# EAGLE schematic tinyio (EAGLE 7.1.0)
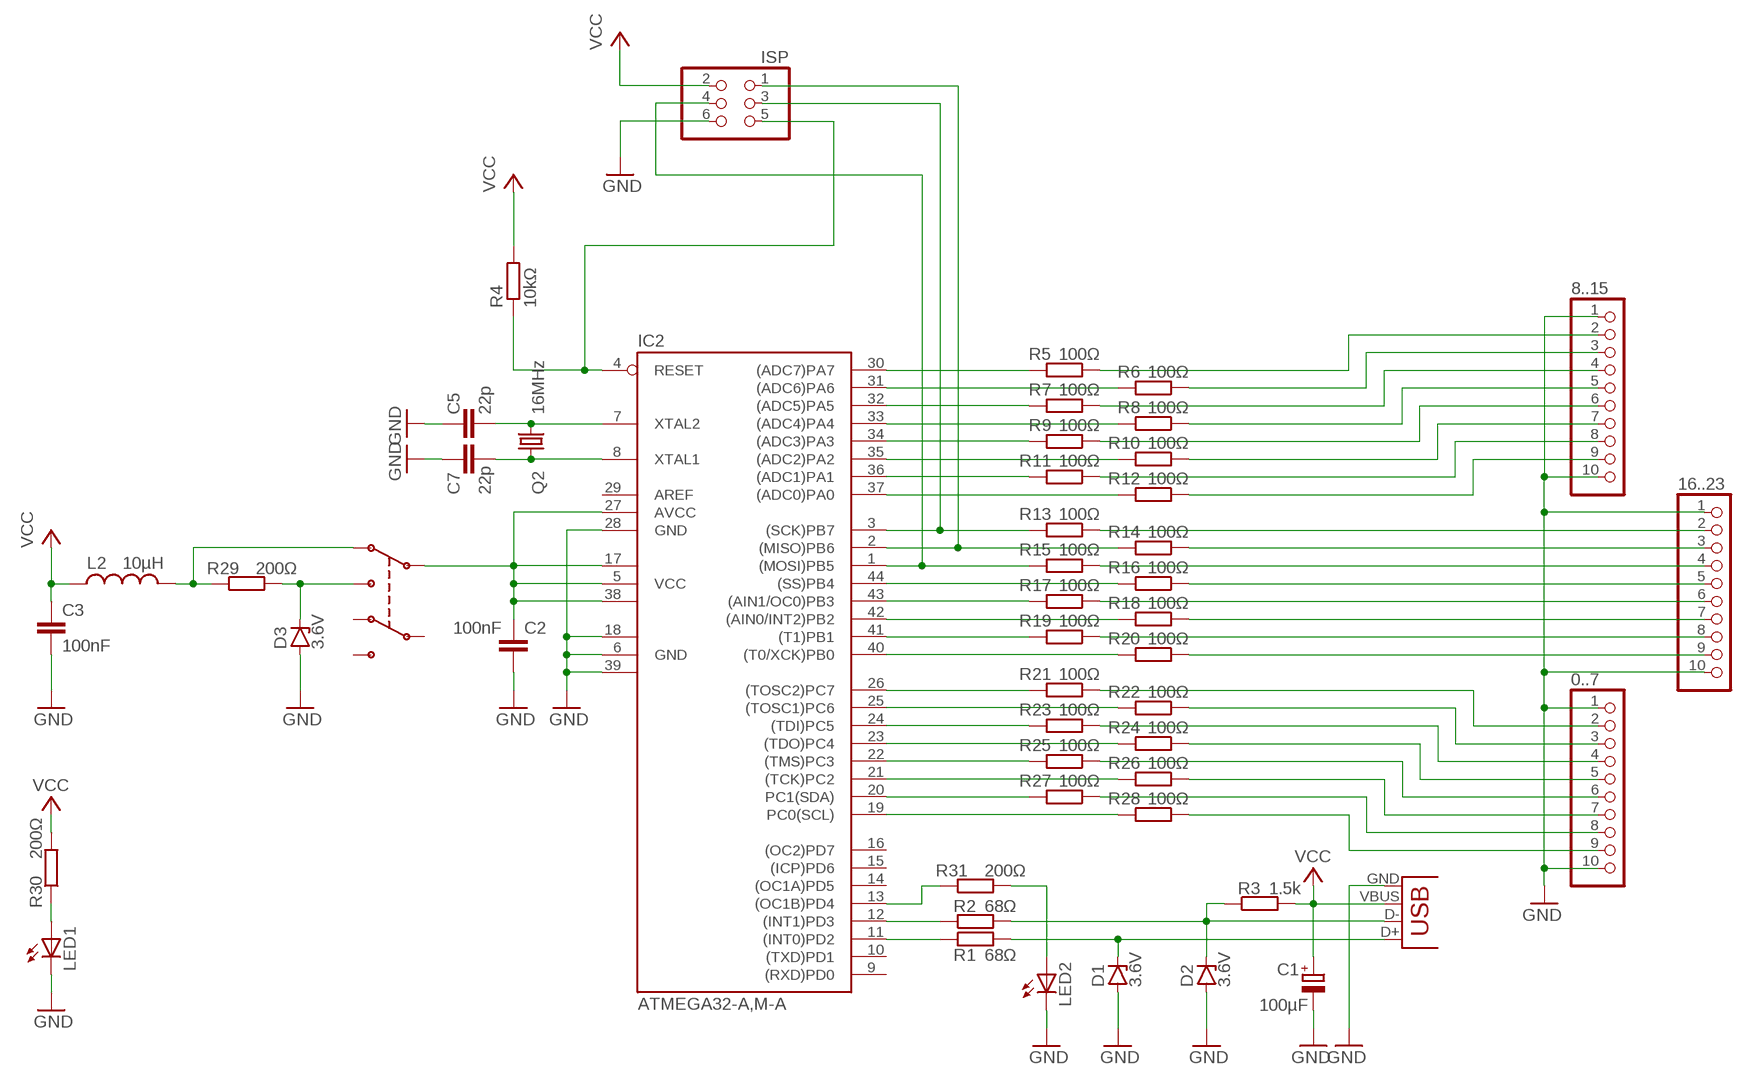
[diagram p0: schematic, sheet 1]

## Parts
0..7  PINHD-1X10_2.54-SMD  [1X10SMD]
8..15  PINHD-1X10_2.54-SMD  [1X10SMD]
16..23  PINHD-1X10_2.54-SMD  [1X10SMD]
C1  100µF  CPOL-EUD/7343-31R  [D/7343-31R]
C2  100nF  C-EUC1206  [C1206]
C3  100nF  C-EUC1206  [C1206]
C5  22p  C-EUC1206  [C1206]
C7  22p  C-EUC1206  [C1206]
D1  3.6V  DIODE-ZENER-0804  [DIODE-ZENER-0805]
D2  3.6V  DIODE-ZENER-0804  [DIODE-ZENER-0805]
D3  3.6V  DIODE-ZENER-0804  [DIODE-ZENER-0805]
IC2  ATMEGA32-A,M-A  [TQFP44]
ISP  PINHD-2X3_2.54-SMD  [2X03SMD]
L2  10µH  L-USL1812  [L1812]
LED1  LEDCHIPLED_0805  [CHIPLED_0805]
LED2  LEDCHIPLED_0805  [CHIPLED_0805]
Q2  16MHz  CSM-7X-DU  [CSM-7X-DU]
R1  68Ω  R-EU_R1206  [R1206]
R2  68Ω  R-EU_R1206  [R1206]
R3  1.5k  R-EU_R1206  [R1206]
R4  10kΩ  R-EU_R0603  [R0603]
R5  100Ω  R-EU_R0603  [R0603]
R6  100Ω  R-EU_R0603  [R0603]
R7  100Ω  R-EU_R0603  [R0603]
R8  100Ω  R-EU_R0603  [R0603]
R9  100Ω  R-EU_R0603  [R0603]
R10  100Ω  R-EU_R0603  [R0603]
R11  100Ω  R-EU_R0603  [R0603]
R12  100Ω  R-EU_R0603  [R0603]
R13  100Ω  R-EU_R0603  [R0603]
R14  100Ω  R-EU_R0603  [R0603]
R15  100Ω  R-EU_R0603  [R0603]
R16  100Ω  R-EU_R0603  [R0603]
R17  100Ω  R-EU_R0603  [R0603]
R18  100Ω  R-EU_R0603  [R0603]
R19  100Ω  R-EU_R0603  [R0603]
R20  100Ω  R-EU_R0603  [R0603]
R21  100Ω  R-EU_R0603  [R0603]
R22  100Ω  R-EU_R0603  [R0603]
R23  100Ω  R-EU_R0603  [R0603]
R24  100Ω  R-EU_R0603  [R0603]
R25  100Ω  R-EU_R0603  [R0603]
R26  100Ω  R-EU_R0603  [R0603]
R27  100Ω  R-EU_R0603  [R0603]
R28  100Ω  R-EU_R0603  [R0603]
R29  200Ω  R-EU_R1206  [R1206]
R30  200Ω  R-EU_R1206  [R1206]
R31  200Ω  R-EU_R1206  [R1206]
U$3  SWTICH-DPDT1  [SWITCH-TOP-DPDT]
X1  USBSMD  [USB-MINIB]

## Nets
GND: 0..7.1 0..7.10 8..15.1 8..15.10 16..23.1 16..23.10 C1.- C2.2 C3.2 C5.1 C7.1 D1.A D2.A D3.A IC2.6(GND) IC2.18(GND1) IC2.28(GND) IC2.39(GND2) ISP.6 LED1.C LED2.C X1.GND
N$1: IC2.12((INT1)PD3) R2.1
N$2: IC2.11((INT0)PD2) R1.1
N$3: D1.K(C) R1.2 X1.D+
N$4: D2.K(C) R2.2 R3.1 X1.D-
N$5: C2.1 IC2.5(VCC) IC2.17(VCC1) IC2.27(AVCC) IC2.38(VCC2) U$3.1
N$6: IC2.4(RESET) ISP.5 R4.1
N$7: IC2.30((ADC7)PA7) R5.2
N$8: IC2.31((ADC6)PA6) R6.2
N$9: IC2.32((ADC5)PA5) R7.2
N$10: IC2.33((ADC4)PA4) R8.2
N$11: IC2.34((ADC3)PA3) R9.2
N$12: LED1.A R30.1
N$13: C7.2 IC2.8(XTAL1) Q2.1
N$14: IC2.35((ADC2)PA2) R10.2
N$15: IC2.36((ADC1)PA1) R11.2
N$16: IC2.37((ADC0)PA0) R12.2
N$17: IC2.3((SCK)PB7) ISP.3 R13.2
N$18: IC2.2((MISO)PB6) ISP.1 R14.2
N$19: IC2.44((SS)PB4) R16.2
N$20: IC2.1((MOSI)PB5) ISP.4 R15.2
N$21: IC2.43((AIN1/OC0)PB3) R17.2
N$22: IC2.42((AIN0/INT2)PB2) R18.2
N$23: IC2.40((T0/XCK)PB0) R20.2
N$24: IC2.41((T1)PB1) R19.2
N$25: IC2.26((TOSC2)PC7) R21.2
N$26: IC2.25((TOSC1)PC6) R22.2
N$27: IC2.23((TDO)PC4) R24.2
N$28: IC2.21((TCK)PC2) R26.2
N$29: IC2.19(PC0(SCL)) R28.2
N$30: IC2.24((TDI)PC5) R23.2
N$31: IC2.22((TMS)PC3) R25.2
N$32: IC2.20(PC1(SDA)) R27.2
N$33: 8..15.2 R5.1
N$34: 8..15.3 R6.1
N$35: 8..15.4 R7.1
N$36: 8..15.5 R8.1
N$37: 8..15.6 R9.1
N$38: 8..15.7 R10.1
N$39: 8..15.8 R11.1
N$40: 8..15.9 R12.1
N$41: 16..23.2 R13.1
N$42: 16..23.3 R14.1
N$43: 16..23.4 R15.1
N$44: 16..23.5 R16.1
N$45: 16..23.6 R17.1
N$46: 16..23.7 R18.1
N$47: 16..23.8 R19.1
N$48: 16..23.9 R20.1
N$49: 0..7.2 R21.1
N$50: 0..7.3 R22.1
N$51: 0..7.4 R23.1
N$52: 0..7.5 R24.1
N$53: 0..7.6 R25.1
N$54: 0..7.7 R26.1
N$55: 0..7.8 R27.1
N$56: 0..7.9 R28.1
N$57: D3.K(C) R29.2 U$3.1NO
N$58: L2.1 R29.1 U$3.1NC
N$59: C5.2 IC2.7(XTAL2) Q2.2
N$60: IC2.13((OC1B)PD4) R31.1
N$61: LED2.A R31.2
VCC: C1.+ C3.1 ISP.2 L2.2 R3.2 R4.2 R30.2 X1.VBUS
Unconnected: IC2.9((RXD)PD0) IC2.10((TXD)PD1) IC2.14((OC1A)PD5) IC2.15((ICP)PD6) IC2.16((OC2)PD7) IC2.29(AREF) U$3.2 U$3.2NC U$3.2NO

## Library data of the parts
0..7 8..15 16..23 = pinhead-1:PINHD-1X10: PIN HEADER
C1 = rcl:CPOL-EU: POLARIZED CAPACITOR, European symbol
C2 C3 C5 C7 = rcl:C-EU: CAPACITOR, European symbol
D1-D3 = mulabs:DIODE-ZENER-0804
IC2 = atmega-atxmega:ATMEGA32-A,M: MICROCONTROLLER 32 Kbytes FLASH 2 Kbytes SRAM 1 Kbytes EEPROM USART 8-channel 10 bit ADC Source: www.atmel.com .. doc2503.pdf; MPN: ATMEGA32-16AU; OC_FARNELL: 9171274; OC_NEWARK: 69K6677
ISP = pinhead-1:PINHD-2X3: PIN HEADER
L2 = rcl:L-US: INDUCTOR, American symbol
LED1 LED2 = led:LED: LED OSRAM: - CHIPLED LG R971, LG N971, LY N971, LG Q971, LY Q971, LO R971, LY R971 LH N974, LH R974 LS Q976, LO Q976, LY Q976 LO Q996 - Hyper CHIPLED LW Q18S LB Q993, LB Q99A, LB R99A - SideLED LS A670, LO A670, LY A670, LG A670, LP A670 LB A673, LV A673, LT A673, LW A673 LH A674 LY A675 LS A676, LA A676, LO A676, LY A676, LW A676 LS A679, LY A679, LG A679 - Hyper Micro SIDELED® LS Y876, LA Y876, LO Y876, LY Y876 LT Y87S - SmartLED LW L88C, LW L88S LB L89C, LB L89S, LG L890 LS L89K, LO L89K, LY L89K LS L896, LA L896, LO L896, LY L896 - TOPLED LS T670, LO T670, LY T670, LG T670, LP T670 LSG T670, LSP T670, LSY T670, LOP T670, LYG T670 LG T671, LOG T671, LSG T671 LB T673, LV T673, LT T673, LW T673 LH T674 LS T676, LA T676, LO T676, LY T676, LB T676, LH T676, LSB T676, LW T676 LB T67C, LV T67C, LT T67C, LS T67K, LO T67K, LY T67K, LW E67C LS E67B, LA E67B, LO E67B, LY E67B, LB E67C, LV E67C, LT E67C LW T67C LS T679, LY T679, LG T679 LS T770, LO T770, LY T770, LG T770, LP T770 LB T773, LV T773, LT T773, LW T773 LH T774 LS E675, LA E675, LY E675, LS T675 LS T776, LA T776, LO T776, LY T776, LB T776 LHGB T686 LT T68C, LB T68C - Hyper Mini TOPLED® LB M676 - Mini TOPLED Santana® LG M470 LS M47K, LO M47K, LY M47K Source: http://www.osram.convergy.de LUXEON: - LUMILED® LXK2-PW12-R00, LXK2-PW12-S00, LXK2-PW14-U00, LXK2-PW14-V00 LXK2-PM12-R00, LXK2-PM12-S00, LXK2-PM14-U00 LXK2-PE12-Q00, LXK2-PE12-R00, LXK2-PE12-S00, LXK2-PE14-T00, LXK2-PE14-U00 LXK2-PB12-K00, LXK2-PB12-L00, LXK2-PB12-M00, LXK2-PB14-N00, LXK2-PB14-P00, LXK2-PB14-Q00 LXK2-PR12-L00, LXK2-PR12-M00, LXK2-PR14-Q00, LXK2-PR14-R00 LXK2-PD12-Q00, LXK2-PD12-R00, LXK2-PD12-S00 LXK2-PH12-R00, LXK2-PH12-S00 LXK2-PL12-P00, LXK2-PL12-Q00, LXK2-PL12-R00 Source: www.luxeon.com KINGBRIGHT: KA-3528ASYC Source: www.kingbright.com
Q2 = crystal:CSM-7X-DU: SMD CRYSTAL Source: www.ecsxtal.com .. Crystal 3.6864MHz CSM_7X_DU.PDF; OC_FARNELL: unknown; OC_NEWARK: unknown
R1-R31 = rcl:R-EU_: RESISTOR, European symbol
U$3 = mulabs:SWTICH-DPDT
X1 = SparkFun:USB: USB Connectors USB-B-PTH is fully proven SKU : PRT-00139 USB-miniB is fully proven SKU : PRT-00587 USB-A-PCB is untested. USB-A-H is throughly reviewed, but untested. Spark Fun Electronics SKU : PRT-00437 USB-B-SMT is throughly reviewed, but untested. Needs silkscreen touching up. USB-A-S has not been used/tested USB-MB-H has not been used/tested